# EAGLE design untitled (EAGLE 7.7.0)
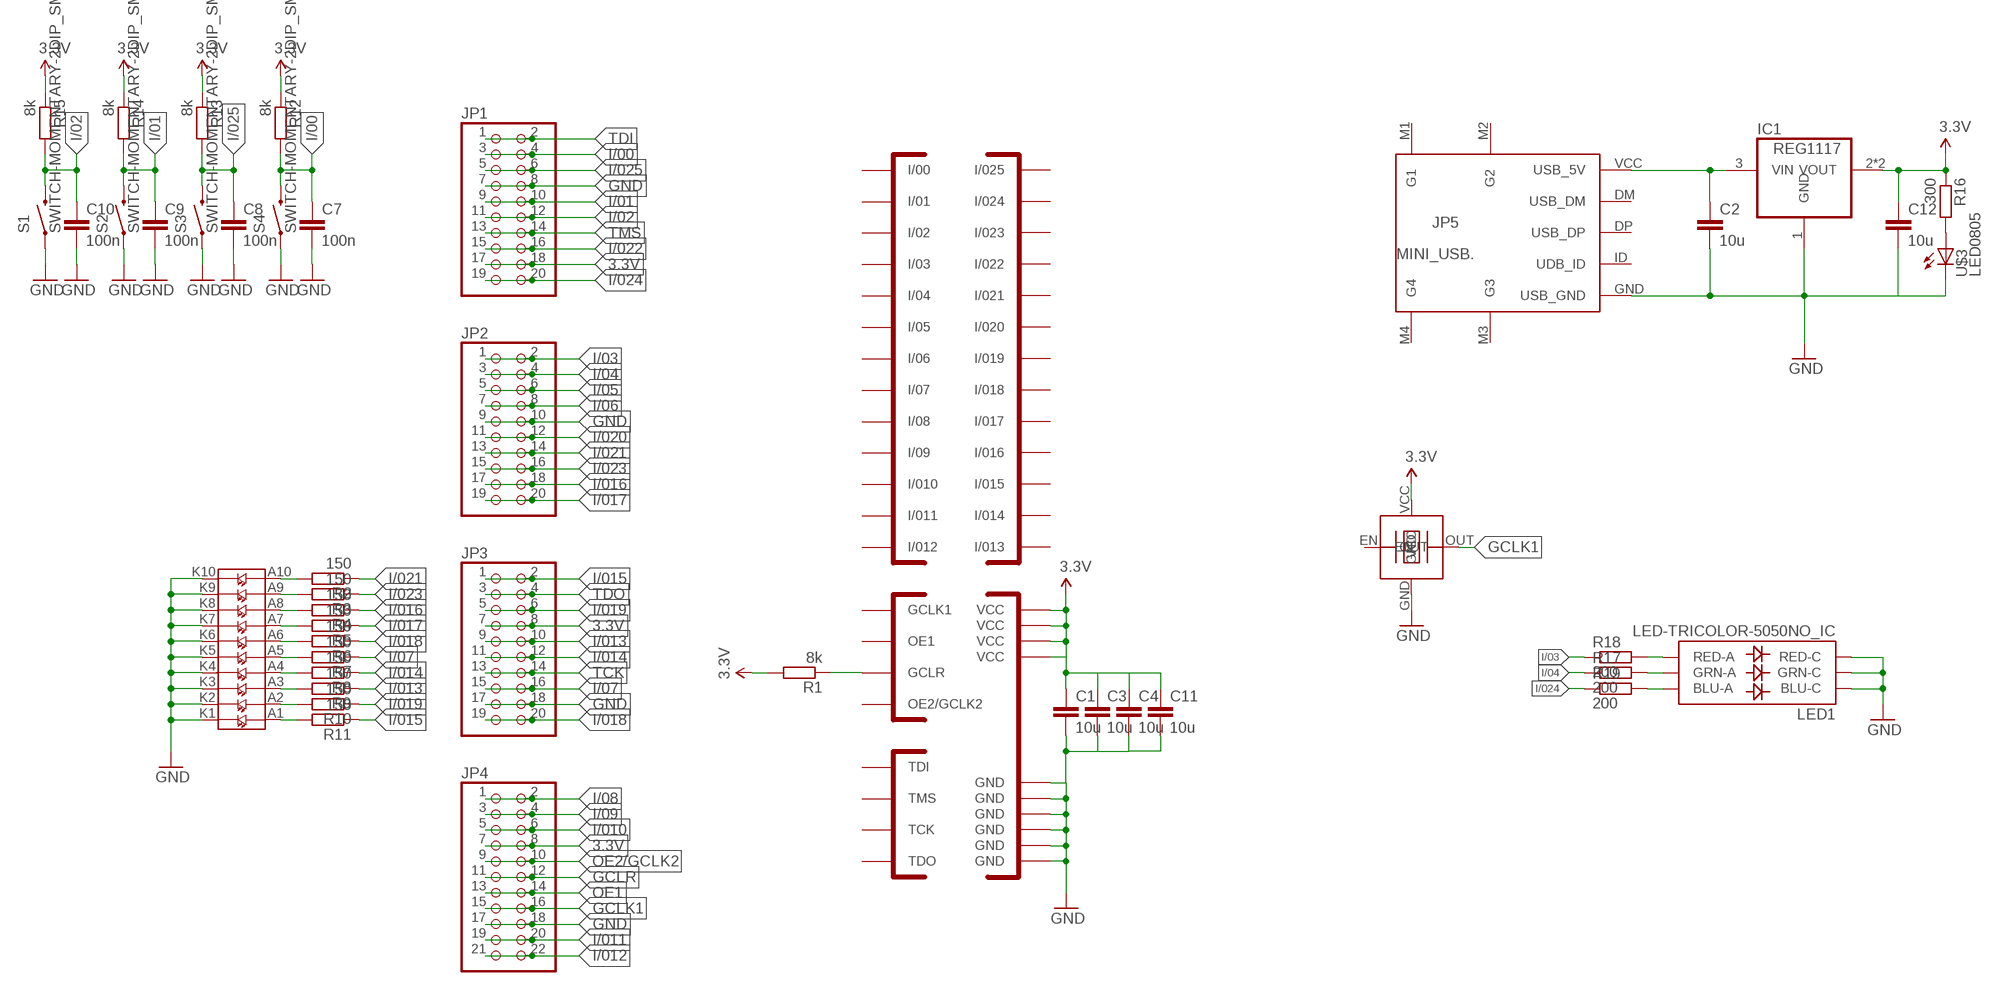
[diagram p0: schematic, sheet 1]

## Parts
C1  10u  CAP0805  [0805]
C2  10u  CC0805  [C0805]
C3  10u  CC0805  [C0805]
C4  10u  CAP0805  [0805]
C7  100n  CC0603  [C0603]
C8  100n  CC0603  [C0603]
C9  100n  CC0603  [C0603]
C10  100n  CC0603  [C0603]
C11  10u  CC0805  [C0805]
C12  10u  CC0805  [C0805]
IC1  REG1117  [SOT223]
JP1  PINHD-2X10_2.54-SMD  [2X10SMD]
JP2  PINHD-2X10_2.54-SMD  [2X10SMD]
JP3  PINHD-2X10_2.54-SMD  [2X10SMD]
JP4  PINHD-2X11_2.54-SMD  [2X11SMD]
JP5  MINI_USB.  [32005-201]
LED1  LED-TRICOLOR-5050NO_IC  [LED-TRICOLOR-5050]
QG1  TXC-BA  [7X5]
R1  8k  R0603  [0603]
R2  150  R0603  [0603]
R3  150  R0603  [0603]
R4  150  R0603  [0603]
R5  150  R0603  [0603]
R6  150  R0603  [0603]
R7  150  R0603  [0603]
R8  150  R0603  [0603]
R9  150  R0603  [0603]
R10  150  R0603  [0603]
R11  150  R0603  [0603]
R12  8k  R0603  [0603]
R13  8k  R0603  [0603]
R14  8k  R0603  [0603]
R15  8k  R0603  [0603]
R16  300  R0603  [0603]
R17  200  R0603  [0603]
R18  200  R0603  [0603]
R19  200  R0603  [0603]
S1  SWITCH-MOMENTARY-2DIP_SMD  [DIP_SMD]
S2  SWITCH-MOMENTARY-2DIP_SMD  [DIP_SMD]
S3  SWITCH-MOMENTARY-2DIP_SMD  [DIP_SMD]
S4  SWITCH-MOMENTARY-2DIP_SMD  [DIP_SMD]
U$1  EPM3032  [TQFP44]
U$2  10LED  [10LED]
U$3  LED0805  [0805-LED]

## Nets
3.3V: C1.1 C3.1 C4.1 C11.1 C12.1 IC1.2(VOUT) IC1.4(VOUT) JP1.17 JP1.18 JP3.7 JP3.8 JP4.7 JP4.8 QG1.VCC R1.2 R12.1 R13.1 R14.1 R15.1 R16.1 U$1.9(VCC) U$1.17(VCC) U$1.29(VCC) U$1.41(VCC)
5V: C2.1 IC1.3(VIN) JP5.VCC(USB_5V)
GCLK1: JP4.15 JP4.16 QG1.OUT
GCLR: JP4.11 JP4.12 R1.1 U$1.39(GCLR)
GND: C1.2 C2.2 C3.2 C4.2 C7.2 C8.2 C9.2 C10.2 C11.2 C12.2 IC1.1(GND) JP1.7 JP1.8 JP2.9 JP2.10 JP3.17 JP3.18 JP4.17 JP4.18 JP5.GND(USB_GND) LED1.4(BLU-C) LED1.5(RED-C) LED1.6(GRN-C) QG1.GND S1.P$1 S1.P$2 S2.P$1 S2.P$2 S3.P$1 S3.P$2 S4.P$1 S4.P$2 U$1.4(GND) U$1.11(GND) U$1.16(GND) U$1.24(GND) U$1.30(GND) U$1.36(GND) U$2.K1 U$2.K2 U$2.K3 U$2.K4 U$2.K5 U$2.K6 U$2.K7 U$2.K8 U$2.K9 U$2.K10 U$3.C
I/00: C7.1 JP1.3 JP1.4 R12.2 S4.P$3 S4.P$4
I/01: C9.1 JP1.9 JP1.10 R14.2 S2.P$3 S2.P$4
I/02: C10.1 JP1.11 JP1.12 R15.2 S1.P$3 S1.P$4
I/03: JP2.1 JP2.2 R18.1
I/04: JP2.3 JP2.4 R17.1
I/05: JP2.5 JP2.6
I/06: JP2.7 JP2.8
I/07: JP3.15 JP3.16 R7.1
I/08: JP4.1 JP4.2
I/09: JP4.3 JP4.4
I/010: JP4.5 JP4.6
I/011: JP4.19 JP4.20
I/012: JP4.21 JP4.22
I/013: JP3.9 JP3.10 R9.1
I/014: JP3.11 JP3.12 R8.1
I/015: JP3.1 JP3.2 R11.1
I/016: JP2.17 JP2.18 R4.1
I/017: JP2.19 JP2.20 R5.1
I/018: JP3.19 JP3.20 R6.1
I/019: JP3.5 JP3.6 R10.1
I/020: JP2.11 JP2.12
I/021: JP2.13 JP2.14 R2.1
I/022: JP1.15 JP1.16
I/023: JP2.15 JP2.16 R3.1
I/024: JP1.19 JP1.20 R19.1
I/025: C8.1 JP1.5 JP1.6 R13.2 S3.P$3 S3.P$4
N$1: R2.2 U$2.A10
N$2: R3.2 U$2.A9
N$3: R4.2 U$2.A8
N$4: R5.2 U$2.A7
N$5: R6.2 U$2.A6
N$6: R7.2 U$2.A5
N$7: R8.2 U$2.A4
N$8: R9.2 U$2.A3
N$9: R10.2 U$2.A2
N$10: R11.2 U$2.A1
N$113: LED1.2(RED-A) R18.2
N$341: R16.2 U$3.A
N$343: LED1.1(GRN-A) R17.2
N$344: LED1.3(BLU-A) R19.2
OE1: JP4.13 JP4.14
OE2/GCLK2: JP4.9 JP4.10
TCK: JP3.13 JP3.14
TDI: JP1.1 JP1.2
TDO: JP3.3 JP3.4
TMS: JP1.13 JP1.14
Unconnected: JP5.DM(USB_DM) JP5.DP(USB_DP) JP5.ID(UDB_ID) JP5.M1(G1) JP5.M2(G2) JP5.M3(G3) JP5.M4(G4) QG1.EN

## Power pins joined to a net without a drawn wire
GCLK1: U$1.37(GCLK1)
I/00: U$1.2(I/00)
I/01: U$1.5(I/01)
I/02: U$1.6(I/02)
I/03: U$1.12(I/03)
I/04: U$1.13(I/04)
I/05: U$1.14(I/05)
I/06: U$1.15(I/06)
I/07: U$1.25(I/07)
I/08: U$1.44(I/08)
I/09: U$1.43(I/09)
I/010: U$1.42(I/010)
I/011: U$1.35(I/011)
I/012: U$1.34(I/012)
I/013: U$1.28(I/013)
I/014: U$1.27(I/014)
I/015: U$1.33(I/015)
I/016: U$1.21(I/016)
I/017: U$1.22(I/017)
I/018: U$1.23(I/018)
I/019: U$1.31(I/019)
I/020: U$1.18(I/020)
I/021: U$1.19(I/021)
I/022: U$1.8(I/022)
I/023: U$1.20(I/023)
I/024: U$1.10(I/024)
I/025: U$1.3(I/025)
OE1: U$1.38(OE1)
OE2/GCLK2: U$1.40(OE2/GCLK2)
TCK: U$1.26(TCK)
TDI: U$1.1(TDI)
TDO: U$1.32(TDO)
TMS: U$1.7(TMS)

## Library data of the parts
C1 C4 = SparkFun-Passives:CAP: Capacitor Standard 0603 ceramic capacitor, and 0.1" leaded capacitor.
C2 C3 C7-C12 = smalsmd:C: Capacitor
IC1 = burr-brown:REG1117: 800mA and 1A Low Dropout (LDO) Positive Regulator 1.8V, 2.5V, 2.85V, 3.3V, 5V, and Adj; MPN: REG1117; OC_FARNELL: 1097566; OC_NEWARK: 14P6981
JP1-JP3 = pinhead-2:PINHD-2X10: PIN HEADER
JP4 = pinhead-2:PINHD-2X11: PIN HEADER
JP5 = connectors:MINI_USB
LED1 = SparkFun-LED:LED-TRICOLOR-5050; PROD_ID: DIO-10298
QG1 = txc:TXC-BA**
R1-R19 = smalsmd:R
S1-S4 = Electromechanical:SWITCH-MOMENTARY-2: Various NO switches- pushbuttons, reed, etc
U$1 = EPM3032:EPM3032
U$2 = strangeLed:10LED
U$3 = smalsmd:LED

## Board
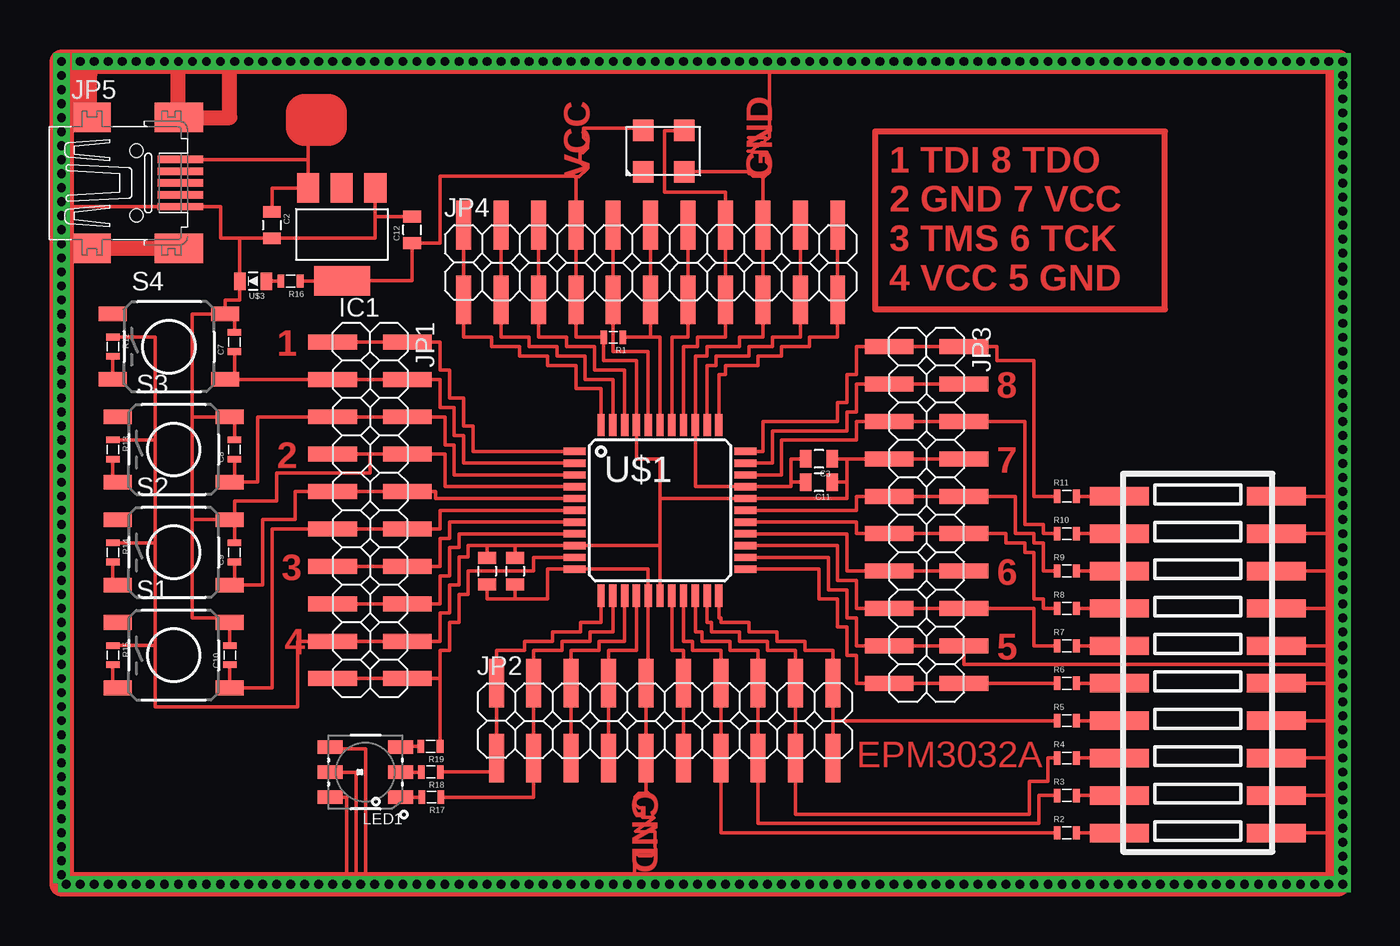
[diagram p1: board, top side]

No outline drawn. Coordinates in mm, seen from the top.
Copper layers (1*16): Top 0.035mm / dielectric 1.5mm / Bottom 0.035mm
Design rules "SparkFun": minimum track width 8mil, minimum drill 20mil, track to track 8mil, track to pad 8mil, pad to pad 8mil, via to via 8mil, smd to smd 8mil, copper to edge 10mil, drill to drill 8mil, minimum pad ring 12mil, minimum via ring 10mil, stop-mask expansion 4mil, vias tented up to drill 25mil, thermal gap 10mil

### Footprints (pad centres in the part's own frame; a part is rotated, then mirrored left to right if it is on the bottom)
0805 = smd 0.8 x 1.2: 1 -0.9,0; 2 0.9,0
C0805 = smd 0.8 x 1.2: 1 -0.9,0; 2 0.9,0
C0603 = smd 0.45 x 0.9: 1 -0.65,0; 2 0.65,0
SOT223 = smd 1.499 x 2.007: 1 -2.261,-3.15; 2 0.025,-3.15; 3 2.311,-3.15 | smd 3.81 x 2.007: 4 0,3.15
2X10SMD = smd 1.016 x 3.302: 1 -1.27,-3.81; 2 -1.27,1.27; 3 1.27,-3.81; 4 1.27,1.27; 5 3.81,-3.81; 6 3.81,1.27; 7 6.35,-3.81; 8 6.35,1.27; 9 8.89,-3.81; 10 8.89,1.27; 11 11.43,-3.81; 12 11.43,1.27; 13 13.97,-3.81; 14 13.97,1.27; 15 16.51,-3.81; 16 16.51,1.27; 17 19.05,-3.81; 18 19.05,1.27; 19 21.59,-3.81; 20 21.59,1.27
2X11SMD = smd 1.016 x 3.302: 1 -1.27,-3.81; 2 -1.27,1.27; 3 1.27,-3.81; 4 1.27,1.27; 5 3.81,-3.81; 6 3.81,1.27; 7 6.35,-3.81; 8 6.35,1.27; 9 8.89,-3.81; 10 8.89,1.27; 11 11.43,-3.81; 12 11.43,1.27; 13 13.97,-3.81; 14 13.97,1.27; 15 16.51,-3.81; 16 16.51,1.27; 17 19.05,-3.81; 18 19.05,1.27; 19 21.59,-3.81; 20 21.59,1.27; 21 24.13,-3.81; 22 24.13,1.27
32005-201 = smd 3.1 x 0.5: DM 3,0.8; DP 3,0; GND 3,-1.6; ID 3,-0.8; VCC 3,1.6 | smd 2.5 x 2: M1 -3,-4.45; M2 -3,4.45 | smd 3.3 x 2: M3 2.9,4.45; M4 2.9,-4.45 | hole 0.9: 0,2.2; 0,-2.2
LED-TRICOLOR-5050 = smd 1.7 x 0.9: 1 -2.4,1.7; 2 -2.4,0; 3 -2.4,-1.7; 4 2.4,-1.7; 5 2.4,0; 6 2.4,1.7
7X5 = smd 1.4 x 1.45: EN -1.448,-1.465; GND 1.333,-1.465; OUT 1.333,1.345; VCC -1.448,1.345
0603 = smd 0.45 x 0.9: 1 -0.65,0; 2 0.65,0
DIP_SMD = smd 1.9 x 1: P$1 -3.81,2.223; P$2 3.81,2.223; P$3 -3.81,-2.223; P$4 3.81,-2.223
TQFP44 = smd 1.5 x 0.5: 1 -5.8,4; 2 -5.8,3.2; 3 -5.8,2.4; 4 -5.8,1.6; 5 -5.8,0.8; 6 -5.8,0; 7 -5.8,-0.8; 8 -5.8,-1.6; 9 -5.8,-2.4; 10 -5.8,-3.2; 11 -5.8,-4; 23 5.8,-4; 24 5.8,-3.2; 25 5.8,-2.4; 26 5.8,-1.6; 27 5.8,-0.8; 28 5.8,0; 29 5.8,0.8; 30 5.8,1.6; 31 5.8,2.4; 32 5.8,3.2; 33 5.8,4 | smd 0.5 x 1.5: 12 -4,-5.8; 13 -3.2,-5.8; 14 -2.4,-5.8; 15 -1.6,-5.8; 16 -0.8,-5.8; 17 0,-5.8; 18 0.8,-5.8; 19 1.6,-5.8; 20 2.4,-5.8; 21 3.2,-5.8; 22 4,-5.8; 34 4,5.8; 35 3.2,5.8; 36 2.4,5.8; 37 1.6,5.8; 38 0.8,5.8; 39 0,5.8; 40 -0.8,5.8; 41 -1.6,5.8; 42 -2.4,5.8; 43 -3.2,5.8; 44 -4,5.8
10LED = smd 1.25 x 4: A1 -11.43,-5.334; A2 -8.89,-5.334; A3 -6.35,-5.334; A4 -3.81,-5.334; A5 -1.27,-5.334; A6 1.27,-5.334; A7 3.81,-5.334; A8 6.35,-5.334; A9 8.89,-5.334; A10 11.43,-5.334; K1 -11.43,5.334; K2 -8.89,5.334; K3 -6.35,5.334; K4 -3.81,5.334; K5 -1.27,5.334; K6 1.27,5.334; K7 3.81,5.334; K8 6.35,5.334; K9 8.89,5.334; K10 11.43,5.334
0805-LED = smd 0.8 x 1.2: A -0.9,0; C 0.9,0

### Placement (x,y rotation side)
C1  30.8,21.27 270 top
C2  14.29,44.77 270 top
C3  51.44,28.89 180 top
C4  28.89,21.27 270 top
C7  11.75,36.83 90 top
C8  11.75,29.53 90 top
C9  11.75,22.54 90 top
C10  11.43,15.56 90 top
C11  51.44,27.3 180 top
C12  23.81,44.45 90 top
IC1  19.05,44.13 180 top
JP1  22.23,35.56 270 top
JP2  30.8,12.38 0 top
JP3  60.01,35.24 270 top
JP4  28.57,43.5 0 top
JP5  5.08,47.62 0 top
LED1  20.64,7.62 180 top
QG1  TXC-BA*  [7X5]  40.96,49.85 0 top
R1  37.47,37.15 180 top
R2  68.26,3.49 0 top
R3  68.26,6.03 0 top
R4  68.26,8.57 0 top
R5  68.26,11.11 0 top
R6  68.26,13.65 0 top
R7  68.26,16.19 0 top
R8  68.26,18.73 0 top
R9  68.26,21.27 0 top
R10  68.26,23.81 0 top
R11  68.26,26.35 0 top
R12  3.49,36.51 270 top
R13  3.49,29.53 270 top
R14  3.49,22.54 270 top
R15  3.49,15.56 270 top
R16  15.56,40.96 180 top
R17  25.12,5.92 180 top
R18  25.08,7.63 180 top
R19  25.06,9.37 180 top
S1  7.62,15.56 0 top
S2  7.62,22.54 0 top
S3  7.62,29.53 0 top
S4  7.3,36.51 0 top
U$1  40.64,25.4 0 top
U$2  77.15,14.92 270 top
U$3  13.02,40.96 180 top

### Tracks (layer width: path | path; a pad name or v marks a point on that pad's centre or on a via)
3.3V
  Top 0.254: JP3.8 JP3.7 53.34,28.89 | 40.64,23 U$1.9 30.8,23 | 40.64,23 U$1.17 | 40.64,26.2 U$1.29 53.34,26.2 53.34,27.3 | 40.64,26.2 40.64,23 | 40.64,26.2 40.64,28.89 39.05,28.89 39.05,31.2 | 6.35,16.21 6.35,12.06 16.04,12.06 16.04,16.51 16.19,16.51 16.19,16.5 JP1.17 JP1.18 25.72,16.51 25.72,18.41 26.35,18.41 26.35,20.32 26.99,20.32 26.99,22.23 27.62,22.23 27.62,23 28.89,23 | 6.35,16.21 6.35,23.19 | 6.35,23.19 6.35,30.18 | 6.35,30.18 6.35,37.15 3.49,37.15 R12.1 | R13.1 6.35,30.18 | R14.1 6.35,23.19 | R15.1 6.35,16.21 | R16.1 19.05,40.96 IC1.4 23.81,40.98 C12.1 25.72,43.55 25.72,48.11 34.85,48.11 34.85,48.05 34.92,48.05 | 34.92,48.05 JP4.8 JP4.7 34.92,37.15 R1.2 36.81,35.56 39.05,35.56 39.05,31.2 | 34.92,48.05 34.94,48.06 35.16,48.06 35.67,48.58 35.67,48.59 35.22,49.05 35.22,49.7 35.41,49.7 35.71,49.99 35.71,50.43 35.44,50.7 35.44,51.36 39.34,51.36 QG1.VCC | 39.05,31.2 U$1.41 | 30.8,23 28.89,23 | C4.1 28.89,23 | C1.1 30.8,23 | 53.34,27.3 53.34,28.89 | C11.1 53.34,27.3 | C3.1 53.34,28.89
5V
  Top 0.254: 16.74,47.62 IC1.3 | C2.1 14.29,47.28 IC1.3 | JP5.VCC 16.74,49.23 IC1.3
GCLK1
  Top 0.254: QG1.OUT 40.96,51.19 40.96,46.99 45.09,46.99 JP4.16 JP4.15 45.09,37.15 43.18,37.15 43.18,36.51 42.23,36.51 42.23,31.2 U$1.37
GCLR
  Top 0.254: JP4.12 JP4.11 40.01,37.15 | U$1.39 40.64,37.15 40.01,37.15 | R1.1 40.01,37.15
GND  (via drill 0.6)
  Top 0.254: U$1.30 43.04,27 U$1.36 43.04,35.88 43.81,35.88 43.81,36.51 46.04,36.51 46.04,37.15 47.62,37.15 JP4.17 JP4.18 47.62,47.94 | 20.95,29.21 JP1.8 26.04,29.21 26.04,27 U$1.4 | 20.95,29.21 JP1.7 17.14,29.21 17.14,28.89 17.12,28.89 17.12,29.03 | U$1.30 46.44,26.99 | C9.2 11.75,24.77 | 11.75,24.77 S2.P$2 8.89,24.77 | C7.2 11.75,38.73 S4.P$2 | C10.2 S1.P$2 11.43,18.1 8.89,18.1 8.89,24.77 | 8.89,24.77 8.89,31.75 | 8.89,31.75 8.89,38.73 S4.P$2 | C8.2 11.75,31.75 S3.P$2 8.89,31.75 | C12.2 21.31,45.35 | 21.31,45.35 IC1.1 | C2.2 21.31,43.87 21.31,45.35 | 0,46.66 0,46.67 | 39.05,0 arc-90 38.92,0.13 38.92,2.15 39.22,1.92 40.08,1.92 40.35,2.15 40.31,2.82 40.3,3.56 38.98,3.61 40.23,4.5 40.19,4.55 39.47,4.55 39.46,4.56 39.46,5.18 39.2,5.18 38.95,5.43 38.95,5.95 39.18,6.18 39.85,6.18 39.69,6.34 JP2.9 JP2.10 39.84,13.65 U$1.16 39.84,21.4 U$1.11 33.02,21.4 33.02,19.37 30.8,19.37 | 86.04,37.15 arc90 86.68,37.47 | 86.04,34.61 arc-90 86.68,34.29 | 86.04,32.07 arc-90 86.68,31.75 | 86.04,26.99 arc-90 86.68,26.67 86.68,26.35 U$2.K1 | 86.04,24.45 arc-90 86.68,24.13 | 86.04,19.37 arc-90 86.68,19.05 | 86.04,25.72 arc-90 86.68,25.4 | 47.62,47.94 47.94,48.26 47.98,48.26 48.08,48.36 48.08,48.83 47.86,49.05 47.86,49.66 47.92,49.72 46.89,49.72 46.81,49.8 | 46.81,49.8 46.86,49.8 47.19,50.13 47.28,50.13 47.52,50.37 47.65,50.37 47.88,50.59 | 47.88,50.59 47.93,50.65 47.98,50.65 48.06,50.73 48.06,55.38 48.24,55.88 48.9,55.56 49.21,55.24 | 46.63,49.8 46.81,49.8 | 46.66,50.72 46.66,50.7 47.76,50.7 arc-90 47.88,50.59 | U$3.C 12.1,40.33 | QG1.GND 46.67,48.38 46.67,48.26 46.8,48.26 46.96,48.09 47.47,48.09 47.62,47.94
  Top 0.254: 17.67,0 19.37,0 19.37,5.92 LED1.6 | C4.2 28.89,19.37 30.8,19.37 | C1.2 30.8,19.37 | U$1.24 52.07,22.2 52.07,20 53.34,20 53.34,18.1 53.98,18.1 53.98,16.19 JP3.17 JP3.18 61.28,14.92 86.68,14.92 86.68,14.61 87,14.61 | U$1.30 49.53,27 49.53,27.3 | 49.53,27.3 49.53,28.89 C3.2 | C11.2 49.53,27.3 | U$2.K2 86.68,23.81 86.68,23.5 | U$2.K3 86.68,21.27 86.68,20.95 | U$2.K4 86.68,18.73 | U$2.K5 86.68,16.19 86.68,15.88 | U$2.K6 86.68,13.65 | U$2.K7 86.68,11.11 86.68,10.79 | U$2.K8 86.68,8.57 86.68,8.26 | U$2.K9 86.68,6.03 86.68,5.71 | U$2.K10 86.68,3.49 86.68,3.17 | 0,45.4 0,46.02 JP5.GND 8.08,46.04 10.79,46.04 10.79,43.87 C2.2 | 0,43.87 0,43.81 | C2.2 12.1,43.87 12.1,40.33 | 12.1,40.33 12.1,39.69 11.11,39.69 S4.P$2 | 20.95,29.21 20.95,27.94 14.61,27.94 14.61,26.04 11.75,26.04 11.75,24.77 | LED1.4 18.24,9.21 20.64,9.21 20.64,0 | LED1.5 20,7.62 20,0
  Top 0.406: 0,52.7 0,45.4
  Top 1.016: 7.94,52.07 7.94,55.88 | 1.91,55.88 1.91,54.93 | 1.91,52.07 1.91,54.93 | 1.91,54.93 0.95,54.93 0.95,53.34 | 7.94,43.18 0,43.18
  Top 1.676: v0,55.88 v1.27,55.88 1.91,55.88 7.94,55.88 48.24,55.88 86.68,55.88 86.68,37.47 86.68,34.29 86.68,31.75 86.68,26.67 86.68,25.4 86.68,24.13 86.68,23.5 86.68,20.95 86.68,19.05 86.68,18.73 86.68,15.88 86.68,14.92 86.68,13.65 86.68,10.79 86.68,8.26 86.68,5.71 86.68,3.17 86.68,0 39.05,0 20.64,0 20,0 19.37,0 v0.32,0 0,0 0,43.18 0,43.81 0,45.4 0,46.67 0,52.7 v0,55.88
I/00
  Top 0.254: C7.1 11.75,34.61 11.43,34.29 S4.P$4 JP1.3 JP1.4 25.72,34.29 25.72,32.38 26.67,32.38 26.67,30.48 27.3,30.48 27.3,28.6 U$1.2 | R12.2 S4.P$3
I/01
  Top 0.254: C9.1 11.75,20.32 S2.P$4 13.65,20.32 13.65,24.77 15.88,24.77 15.88,26.67 JP1.9 JP1.10 25.4,26.67 25.4,26.2 U$1.5 | R14.2 3.49,20.32 S2.P$3
I/02
  Top 0.254: C10.1 S1.P$4 14.29,13.34 14.29,24.13 JP1.11 JP1.12 25.72,24.13 25.72,25.4 U$1.6 | S1.P$3 3.49,13.34 R15.2
I/03
  Top 0.254: U$1.12 36.64,17.78 35.24,17.78 35.24,17.14 33.34,17.14 33.34,16.51 31.43,16.51 31.43,15.88 29.53,15.88 JP2.2 JP2.1 29.53,7.63 R18.1
I/04
  Top 0.254: U$1.13 37.47,19.6 37.47,17.14 35.88,17.14 35.88,16.51 33.97,16.51 33.97,15.88 32.07,15.88 JP2.4 JP2.3 32.07,5.92 R17.1
I/05
  Top 0.254: JP2.5 JP2.6 34.61,15.88 36.51,15.88 36.51,16.51 38.24,16.51 U$1.14
I/06
  Top 0.254: JP2.7 JP2.8 37.15,15.88 39.04,15.88 U$1.15
I/07
  Top 0.254: U$1.25 52.7,23 52.7,20.64 53.98,20.64 53.98,18.73 JP3.15 JP3.16 66.04,18.73 66.04,16.19 R7.1
I/08
  Top 0.254: JP4.2 JP4.1 27.3,37.15 29.21,37.15 29.21,36.51 31.11,36.51 31.11,35.88 33.02,35.88 33.02,35.24 34.92,35.24 34.92,33.66 36.64,33.66 U$1.44
I/09
  Top 0.254: JP4.4 JP4.3 29.84,37.15 31.75,37.15 31.75,36.51 33.66,36.51 33.66,35.88 35.56,35.88 35.56,34.29 37.44,34.29 U$1.43
I/010
  Top 0.254: JP4.6 JP4.5 32.38,37.15 34.29,37.15 34.29,36.51 36.2,36.51 36.2,34.92 38.24,34.92 U$1.42
I/011
  Top 0.254: JP4.20 JP4.19 50.16,37.15 48.26,37.15 48.26,36.51 46.67,36.51 46.67,35.88 44.45,35.88 44.45,35.24 43.84,35.24 U$1.35
I/012
  Top 0.254: JP4.22 JP4.21 52.7,37.15 50.8,37.15 50.8,36.51 48.9,36.51 48.9,35.88 47.31,35.88 47.31,35.24 45.09,35.24 45.09,34.61 44.64,34.61 U$1.34
I/013
  Top 0.254: U$1.28 53.98,25.4 53.98,26.35 JP3.9 JP3.10 64.77,26.35 64.77,23.81 66.04,23.81 66.04,23.18 66.67,23.18 66.67,21.27 R9.1
I/014
  Top 0.254: U$1.27 53.98,24.6 53.98,23.81 JP3.11 JP3.12 64.14,23.81 64.14,23.18 65.41,23.18 65.41,22.54 66.04,22.54 66.04,19.37 66.67,19.37 66.67,18.73 R8.1
I/015
  Top 0.254: U$1.33 47.62,29.4 47.62,31.43 52.7,31.43 52.7,32.7 53.34,32.7 53.34,34.61 53.98,34.61 53.98,36.51 JP3.1 JP3.2 63.5,36.51 63.5,35.56 66.04,35.56 66.04,26.35 R11.1
I/016
  Top 0.254: U$1.21 43.84,17.78 44.13,17.78 44.13,17.14 46.04,17.14 46.04,16.51 47.94,16.51 47.94,15.88 49.85,15.88 JP2.18 JP2.17 49.85,4.76 65.72,4.76 65.72,6.99 66.99,6.99 66.99,8.57 R4.1
I/017
  Top 0.254: 52.39,11.11 JP2.20 52.39,15.88 50.48,15.88 50.48,16.51 48.58,16.51 48.58,17.14 46.67,17.14 46.67,17.78 44.77,17.78 44.77,18.1 44.64,18.1 U$1.22 | 52.39,11.11 JP2.19 | R5.1 52.39,11.11
I/018
  Top 0.254: U$1.23 51.44,21.4 51.44,19.37 52.7,19.37 52.7,17.46 53.34,17.46 53.34,15.56 53.98,15.56 53.98,13.65 JP3.19 JP3.20 R6.1
I/019
  Top 0.254: U$1.31 48.9,27.8 48.9,30.16 53.98,30.16 53.98,31.43 JP3.5 JP3.6 65.41,31.43 65.41,24.45 66.67,24.45 66.67,23.81 R10.1
I/020
  Top 0.254: JP2.11 JP2.12 42.23,15.88 41.44,15.88 U$1.18
I/021
  Top 0.254: U$1.19 42.23,19.6 42.23,16.51 42.86,16.51 42.86,15.88 44.77,15.88 JP2.14 JP2.13 44.77,3.49 R2.1
I/022
  Top 0.254: JP1.15 JP1.16 25.72,19.05 25.72,20.95 26.35,20.95 26.35,22.86 26.99,22.86 26.99,23.8 U$1.8
I/023
  Top 0.254: U$1.20 43.04,17.14 43.5,17.14 43.5,16.51 45.4,16.51 45.4,15.88 47.31,15.88 JP2.16 JP2.15 47.31,4.13 66.36,4.13 66.36,6.03 R3.1
I/024
  Top 0.254: U$1.10 32.07,22.2 32.07,21.27 27.62,21.27 27.62,19.68 26.99,19.68 26.99,17.78 26.35,17.78 26.35,15.88 25.72,15.88 25.72,13.97 | 25.72,13.97 JP1.20 JP1.19 | R19.1 25.72,13.97
I/025
  Top 0.254: C8.1 11.75,27.3 S3.P$4 13.34,27.3 13.34,31.75 JP1.5 JP1.6 26.04,31.75 26.04,29.84 26.67,29.84 26.67,27.8 U$1.3 | R13.2 3.49,27.3 S3.P$3
N$1
  Top 0.254: R2.2 U$2.A10
N$2
  Top 0.254: R3.2 U$2.A9
N$3
  Top 0.254: R4.2 U$2.A8
N$4
  Top 0.254: R5.2 U$2.A7
N$5
  Top 0.254: R6.2 U$2.A6
N$6
  Top 0.254: R7.2 U$2.A5
N$7
  Top 0.254: R8.2 U$2.A4
N$8
  Top 0.254: R9.2 U$2.A3
N$9
  Top 0.254: R10.2 U$2.A2
N$10
  Top 0.254: R11.2 U$2.A1
N$11
  Top 0.254: 16.83,47.31 16.75,47.31 16.75,51.52
  Top 2.54: 16.75,51.52 16.83,51.52 16.83,51.44 18.1,51.44 18.1,52.39 16.51,52.39 16.51,51.44
N$12
  Top 1.016: 8.26,52.07 11.43,52.07 11.43,55.56
N$13  (via drill 0.6)
  other vias: 5.08,55.88
N$14  (via drill 0.6)
  other vias: 6.03,55.88
N$15  (via drill 0.6)
  other vias: 6.99,55.88
N$16  (via drill 0.6)
  other vias: 7.94,55.88
N$17  (via drill 0.6)
  other vias: 8.89,55.88
N$18  (via drill 0.6)
  other vias: 9.84,55.88
N$19  (via drill 0.6)
  other vias: 10.79,55.88
N$20  (via drill 0.6)
  other vias: 11.75,55.88
N$21  (via drill 0.6)
  other vias: 12.7,55.88
N$22  (via drill 0.6)
  other vias: 13.65,55.88
N$23  (via drill 0.6)
  other vias: 14.61,55.88
N$24  (via drill 0.6)
  other vias: 15.56,55.88
N$25  (via drill 0.6)
  other vias: 16.51,55.88
N$26  (via drill 0.6)
  other vias: 17.46,55.88
N$27  (via drill 0.6)
  other vias: 18.41,55.88
N$28  (via drill 0.6)
  other vias: 19.37,55.88
N$29  (via drill 0.6)
  other vias: 20.32,55.88
N$30  (via drill 0.6)
  other vias: 21.27,55.88
N$31  (via drill 0.6)
  other vias: 22.23,55.88
N$32  (via drill 0.6)
  other vias: 23.18,55.88
N$33  (via drill 0.6)
  other vias: 24.13,55.88
N$34  (via drill 0.6)
  other vias: 25.08,55.88
N$35  (via drill 0.6)
  other vias: 26.04,55.88
N$36  (via drill 0.6)
  other vias: 26.99,55.88
N$37  (via drill 0.6)
  other vias: 27.94,55.88
N$38  (via drill 0.6)
  other vias: 28.89,55.88
N$39  (via drill 0.6)
  other vias: 29.84,55.88
N$40  (via drill 0.6)
  other vias: 30.8,55.88
N$41  (via drill 0.6)
  other vias: 31.75,55.88
N$42  (via drill 0.6)
  other vias: 32.7,55.88
N$43  (via drill 0.6)
  other vias: 33.66,55.88
N$44  (via drill 0.6)
  other vias: 34.61,55.88
N$45  (via drill 0.6)
  other vias: 35.56,55.88
N$46  (via drill 0.6)
  other vias: 36.51,55.88
N$47  (via drill 0.6)
  other vias: 37.47,55.88
N$48  (via drill 0.6)
  other vias: 38.42,55.88
N$49  (via drill 0.6)
  other vias: 39.37,55.88
N$50  (via drill 0.6)
  other vias: 40.32,55.88
N$51  (via drill 0.6)
  other vias: 41.27,55.88
N$52  (via drill 0.6)
  other vias: 42.23,55.88
N$53  (via drill 0.6)
  other vias: 43.18,55.88
N$54  (via drill 0.6)
  other vias: 44.13,55.88
N$55  (via drill 0.6)
  other vias: 45.09,55.88
N$56  (via drill 0.6)
  other vias: 46.04,55.88
N$57  (via drill 0.6)
  other vias: 46.99,55.88
N$58  (via drill 0.6)
  other vias: 47.94,55.88
N$59  (via drill 0.6)
  other vias: 48.9,55.88
N$60  (via drill 0.6)
  other vias: 49.85,55.88
N$61  (via drill 0.6)
  other vias: 50.8,55.88
N$62  (via drill 0.6)
  other vias: 51.75,55.88
N$63  (via drill 0.6)
  other vias: 52.7,55.88
N$64  (via drill 0.6)
  other vias: 53.66,55.88
N$65  (via drill 0.6)
  other vias: 54.61,55.88
N$66  (via drill 0.6)
  other vias: 55.56,55.88
N$67  (via drill 0.6)
  other vias: 56.52,55.88
N$68  (via drill 0.6)
  other vias: 57.47,55.88
N$69  (via drill 0.6)
  other vias: 58.42,55.88
N$70  (via drill 0.6)
  other vias: 59.37,55.88
N$71  (via drill 0.6)
  other vias: 60.33,55.88
N$72  (via drill 0.6)
  other vias: 61.28,55.88
N$73  (via drill 0.6)
  other vias: 62.23,55.88
N$74  (via drill 0.6)
  other vias: 63.18,55.88
N$75  (via drill 0.6)
  other vias: 64.14,55.88
N$76  (via drill 0.6)
  other vias: 65.09,55.88
N$77  (via drill 0.6)
  other vias: 66.04,55.88
N$78  (via drill 0.6)
  other vias: 66.99,55.88
N$79  (via drill 0.6)
  other vias: 67.94,55.88
N$80  (via drill 0.6)
  other vias: 68.9,55.88
N$81  (via drill 0.6)
  other vias: 69.85,55.88
N$82  (via drill 0.6)
  other vias: 70.8,55.88
N$83  (via drill 0.6)
  other vias: 71.75,55.88
N$84  (via drill 0.6)
  other vias: 72.71,55.88
N$85  (via drill 0.6)
  other vias: 73.66,55.88
N$86  (via drill 0.6)
  other vias: 74.61,55.88
N$87  (via drill 0.6)
  other vias: 75.56,55.88
N$88  (via drill 0.6)
  other vias: 76.52,55.88
N$89  (via drill 0.6)
  other vias: 77.47,55.88
N$90  (via drill 0.6)
  other vias: 78.42,55.88
N$91  (via drill 0.6)
  other vias: 79.38,55.88
N$92  (via drill 0.6)
  other vias: 81.28,55.88
N$93  (via drill 0.6)
  other vias: 83.19,55.88
N$94  (via drill 0.6)
  other vias: 85.09,55.88
N$97  (via drill 0.6)
  other vias: 80.33,55.88
N$98  (via drill 0.6)
  other vias: 82.23,55.88
N$99  (via drill 0.6)
  other vias: 84.14,55.88
N$103  (via drill 0.6)
  other vias: 86.04,55.88
N$107  (via drill 0.6)
  other vias: 87,55.88
N$108  (via drill 0.6)
  other vias: 87,54.93
N$109  (via drill 0.6)
  other vias: 4.13,0
N$110  (via drill 0.6)
  other vias: 5.08,0
N$111  (via drill 0.6)
  other vias: 0,54.93
N$113
  Top 0.254: LED1.2 R18.2
N$118  (via drill 0.6)
  other vias: 2.22,55.88
N$119  (via drill 0.6)
  other vias: 3.17,55.88
N$120  (via drill 0.6)
  other vias: 4.13,55.88
N$121  (via drill 0.6)
  other vias: 6.03,0
N$122  (via drill 0.6)
  other vias: 6.99,0
N$123  (via drill 0.6)
  other vias: 7.94,0
N$124  (via drill 0.6)
  other vias: 8.89,0
N$125  (via drill 0.6)
  other vias: 9.84,0
N$126  (via drill 0.6)
  other vias: 10.79,0
N$127  (via drill 0.6)
  other vias: 11.75,0
N$128  (via drill 0.6)
  other vias: 12.7,0
N$129  (via drill 0.6)
  other vias: 13.65,0
N$130  (via drill 0.6)
  other vias: 14.61,0
N$131  (via drill 0.6)
  other vias: 15.56,0
N$132  (via drill 0.6)
  other vias: 16.51,0
N$133  (via drill 0.6)
  other vias: 17.46,0
N$134  (via drill 0.6)
  other vias: 18.41,0
N$135  (via drill 0.6)
  other vias: 19.37,0
N$136  (via drill 0.6)
  other vias: 20.32,0
N$137  (via drill 0.6)
  other vias: 21.27,0
N$138  (via drill 0.6)
  other vias: 22.23,0
N$139  (via drill 0.6)
  other vias: 23.18,0
N$140  (via drill 0.6)
  other vias: 24.13,0
N$141  (via drill 0.6)
  other vias: 25.08,0
N$142  (via drill 0.6)
  other vias: 26.04,0
N$143  (via drill 0.6)
  other vias: 26.99,0
N$144  (via drill 0.6)
  other vias: 27.94,0
N$145  (via drill 0.6)
  other vias: 28.89,0
N$146  (via drill 0.6)
  other vias: 29.84,0
N$147  (via drill 0.6)
  other vias: 30.8,0
N$148  (via drill 0.6)
  other vias: 31.75,0
N$149  (via drill 0.6)
  other vias: 32.7,0
N$150  (via drill 0.6)
  other vias: 33.66,0
N$151  (via drill 0.6)
  other vias: 34.61,0
N$152  (via drill 0.6)
  other vias: 35.56,0
N$153  (via drill 0.6)
  other vias: 36.51,0
N$154  (via drill 0.6)
  other vias: 37.47,0
N$155  (via drill 0.6)
  other vias: 38.42,0
N$156  (via drill 0.6)
  other vias: 39.37,0
N$157  (via drill 0.6)
  other vias: 40.32,0
N$158  (via drill 0.6)
  other vias: 41.27,0
N$159  (via drill 0.6)
  other vias: 42.23,0
N$160  (via drill 0.6)
  other vias: 43.18,0
N$161  (via drill 0.6)
  other vias: 44.13,0
N$162  (via drill 0.6)
  other vias: 45.09,0
N$163  (via drill 0.6)
  other vias: 46.04,0
N$164  (via drill 0.6)
  other vias: 46.99,0
N$165  (via drill 0.6)
  other vias: 47.94,0
N$166  (via drill 0.6)
  other vias: 48.9,0
N$167  (via drill 0.6)
  other vias: 49.85,0
N$168  (via drill 0.6)
  other vias: 50.8,0
N$169  (via drill 0.6)
  other vias: 51.75,0
N$170  (via drill 0.6)
  other vias: 52.7,0
N$171  (via drill 0.6)
  other vias: 53.66,0
N$172  (via drill 0.6)
  other vias: 54.61,0
N$173  (via drill 0.6)
  other vias: 55.56,0
N$174  (via drill 0.6)
  other vias: 56.52,0
N$175  (via drill 0.6)
  other vias: 57.47,0
N$176  (via drill 0.6)
  other vias: 58.42,0
N$177  (via drill 0.6)
  other vias: 59.37,0
N$178  (via drill 0.6)
  other vias: 60.33,0
N$179  (via drill 0.6)
  other vias: 61.28,0
N$180  (via drill 0.6)
  other vias: 62.23,0
N$181  (via drill 0.6)
  other vias: 63.18,0
N$182  (via drill 0.6)
  other vias: 64.14,0
N$183  (via drill 0.6)
  other vias: 65.09,0
N$184  (via drill 0.6)
  other vias: 66.04,0
N$185  (via drill 0.6)
  other vias: 66.99,0
N$186  (via drill 0.6)
  other vias: 67.94,0
N$187  (via drill 0.6)
  other vias: 68.9,0
N$188  (via drill 0.6)
  other vias: 69.85,0
N$189  (via drill 0.6)
  other vias: 70.8,0
N$190  (via drill 0.6)
  other vias: 71.75,0
N$191  (via drill 0.6)
  other vias: 72.71,0
N$192  (via drill 0.6)
  other vias: 73.66,0
N$193  (via drill 0.6)
  other vias: 74.61,0
N$194  (via drill 0.6)
  other vias: 75.56,0
N$195  (via drill 0.6)
  other vias: 76.52,0
N$196  (via drill 0.6)
  other vias: 77.47,0
N$197  (via drill 0.6)
  other vias: 78.42,0
N$198  (via drill 0.6)
  other vias: 79.38,0
N$200  (via drill 0.6)
  other vias: 80.33,0
N$203  (via drill 0.6)
  other vias: 84.14,0
N$207  (via drill 0.6)
  other vias: 82.23,0
N$210  (via drill 0.6)
  other vias: 81.28,0
N$211  (via drill 0.6)
  other vias: 83.19,0
N$212  (via drill 0.6)
  other vias: 86.04,0
N$213  (via drill 0.6)
  other vias: 85.09,0
N$214  (via drill 0.6)
  other vias: 0,9.21
N$222  (via drill 0.6)
  other vias: 1.27,0
N$223  (via drill 0.6)
  other vias: 2.22,0
N$224  (via drill 0.6)
  other vias: 3.17,0
N$225  (via drill 0.6)
  other vias: 0,10.16
N$226  (via drill 0.6)
  other vias: 0,11.11
N$227  (via drill 0.6)
  other vias: 0,12.06
N$228  (via drill 0.6)
  other vias: 0,13.02
N$229  (via drill 0.6)
  other vias: 0,13.97
N$230  (via drill 0.6)
  other vias: 0,14.92
N$231  (via drill 0.6)
  other vias: 0,15.88
N$232  (via drill 0.6)
  other vias: 0,16.83
N$233  (via drill 0.6)
  other vias: 0,17.78
N$234  (via drill 0.6)
  other vias: 0,18.73
N$235  (via drill 0.6)
  other vias: 0,19.68
N$236  (via drill 0.6)
  other vias: 0,20.64
N$237  (via drill 0.6)
  other vias: 0,21.59
N$238  (via drill 0.6)
  other vias: 0,22.54
N$239  (via drill 0.6)
  other vias: 0,23.5
N$240  (via drill 0.6)
  other vias: 0,24.45
N$241  (via drill 0.6)
  other vias: 0,25.4
N$242  (via drill 0.6)
  other vias: 0,26.35
N$243  (via drill 0.6)
  other vias: 0,27.3
N$244  (via drill 0.6)
  other vias: 0,28.26
N$245  (via drill 0.6)
  other vias: 0,29.21
N$246  (via drill 0.6)
  other vias: 0,30.16
N$247  (via drill 0.6)
  other vias: 0,31.11
N$248  (via drill 0.6)
  other vias: 0,32.07
N$249  (via drill 0.6)
  other vias: 0,33.02
N$250  (via drill 0.6)
  other vias: 0,33.97
N$251  (via drill 0.6)
  other vias: 0,34.92
N$252  (via drill 0.6)
  other vias: 0,35.88
N$253  (via drill 0.6)
  other vias: 0,36.83
N$254  (via drill 0.6)
  other vias: 0,37.78
N$255  (via drill 0.6)
  other vias: 0,38.73
N$256  (via drill 0.6)
  other vias: 0,39.69
N$257  (via drill 0.6)
  other vias: 0,40.64
N$258  (via drill 0.6)
  other vias: 0,41.59
N$259  (via drill 0.6)
  other vias: 0,42.55
N$260  (via drill 0.6)
  other vias: 0,43.5
N$261  (via drill 0.6)
  other vias: 0,44.45
N$262  (via drill 0.6)
  other vias: 0,45.4
N$263  (via drill 0.6)
  other vias: 0,46.35
N$264  (via drill 0.6)
  other vias: 0,47.31
N$265  (via drill 0.6)
  other vias: 0,48.26
N$266  (via drill 0.6)
  other vias: 0,49.21
N$267  (via drill 0.6)
  other vias: 0,50.16
N$268  (via drill 0.6)
  other vias: 0,51.12
N$269  (via drill 0.6)
  other vias: 0,52.07
N$270  (via drill 0.6)
  other vias: 0,53.02
N$271  (via drill 0.6)
  other vias: 0,53.98
N$273  (via drill 0.6)
  other vias: 0,0.64
N$274  (via drill 0.6)
  other vias: 0,1.59
N$275  (via drill 0.6)
  other vias: 0,2.54
N$276  (via drill 0.6)
  other vias: 0,3.49
N$277  (via drill 0.6)
  other vias: 0,4.45
N$278  (via drill 0.6)
  other vias: 0,5.4
N$279  (via drill 0.6)
  other vias: 0,6.35
N$280  (via drill 0.6)
  other vias: 0,7.3
N$281  (via drill 0.6)
  other vias: 0,8.26
N$282  (via drill 0.6)
  other vias: 87,9.53
N$283  (via drill 0.6)
  other vias: 87,10.48
N$284  (via drill 0.6)
  other vias: 87,11.43
N$285  (via drill 0.6)
  other vias: 87,12.38
N$286  (via drill 0.6)
  other vias: 87,13.34
N$287  (via drill 0.6)
  other vias: 87,14.29
N$288  (via drill 0.6)
  other vias: 87,15.24
N$289  (via drill 0.6)
  other vias: 87,16.19
N$290  (via drill 0.6)
  other vias: 87,17.14
N$291  (via drill 0.6)
  other vias: 87,18.1
N$292  (via drill 0.6)
  other vias: 87,19.05
N$293  (via drill 0.6)
  other vias: 87,20
N$294  (via drill 0.6)
  other vias: 87,20.95
N$295  (via drill 0.6)
  other vias: 87,21.91
N$296  (via drill 0.6)
  other vias: 87,22.86
N$297  (via drill 0.6)
  other vias: 87,23.81
N$298  (via drill 0.6)
  other vias: 87,24.77
N$299  (via drill 0.6)
  other vias: 87,25.72
N$300  (via drill 0.6)
  other vias: 87,26.67
N$301  (via drill 0.6)
  other vias: 87,27.62
N$302  (via drill 0.6)
  other vias: 87,28.57
N$303  (via drill 0.6)
  other vias: 87,29.53
N$304  (via drill 0.6)
  other vias: 87,30.48
N$305  (via drill 0.6)
  other vias: 87,31.43
N$306  (via drill 0.6)
  other vias: 87,32.38
N$307  (via drill 0.6)
  other vias: 87,33.34
N$308  (via drill 0.6)
  other vias: 87,34.29
N$309  (via drill 0.6)
  other vias: 87,35.24
N$310  (via drill 0.6)
  other vias: 87,36.2
N$311  (via drill 0.6)
  other vias: 87,37.15
N$312  (via drill 0.6)
  other vias: 87,38.1
N$313  (via drill 0.6)
  other vias: 87,39.05
N$314  (via drill 0.6)
  other vias: 87,40.01
N$315  (via drill 0.6)
  other vias: 87,40.96
N$316  (via drill 0.6)
  other vias: 87,41.91
N$317  (via drill 0.6)
  other vias: 87,42.86
N$318  (via drill 0.6)
  other vias: 87,43.81
N$319  (via drill 0.6)
  other vias: 87,44.77
N$320  (via drill 0.6)
  other vias: 87,45.72
N$321  (via drill 0.6)
  other vias: 87,46.67
N$322  (via drill 0.6)
  other vias: 87,47.62
N$323  (via drill 0.6)
  other vias: 87,48.58
N$324  (via drill 0.6)
  other vias: 87,49.53
N$325  (via drill 0.6)
  other vias: 87,50.48
N$326  (via drill 0.6)
  other vias: 87,51.44
N$327  (via drill 0.6)
  other vias: 87,52.39
N$328  (via drill 0.6)
  other vias: 87,53.34
N$329  (via drill 0.6)
  other vias: 87,54.29
N$330  (via drill 0.6)
  other vias: 87,0
N$331  (via drill 0.6)
  other vias: 87,0.95
N$332  (via drill 0.6)
  other vias: 87,1.91
N$333  (via drill 0.6)
  other vias: 87,2.86
N$334  (via drill 0.6)
  other vias: 87,3.81
N$335  (via drill 0.6)
  other vias: 87,4.76
N$336  (via drill 0.6)
  other vias: 87,5.71
N$337  (via drill 0.6)
  other vias: 87,6.67
N$338  (via drill 0.6)
  other vias: 87,7.62
N$339  (via drill 0.6)
  other vias: 87,8.57
N$341
  Top 0.254: R16.2 U$3.A
N$343
  Top 0.254: R17.2 LED1.1 | LED1.1
N$344
  Top 0.254: R19.2 23.04,9.37 LED1.3
N$345
  Top 0.406: 55.24,51.12 55.24,39.05 74.93,39.05 74.93,51.12 55.24,51.12
OE1
  Top 0.254: JP4.14 JP4.13 42.55,37.15 41.44,37.15 U$1.38
OE2/GCLK2
  Top 0.254: JP4.10 JP4.9 37.47,36.2 39.84,36.2 U$1.40
TCK
  Top 0.254: JP3.14 JP3.13 53.34,21.27 53.34,23.8 U$1.26
TDI
  Top 0.254: JP1.1 JP1.2 25.72,36.83 25.72,34.92 26.35,34.92 26.35,33.02 27.3,33.02 27.3,31.11 27.94,31.11 27.94,29.4 U$1.1
TDO
  Top 0.254: JP3.4 JP3.3 53.98,33.97 53.98,32.07 53.34,32.07 53.34,30.8 48.26,30.8 48.26,28.6 U$1.32
TMS
  Top 0.254: JP1.13 JP1.14 25.72,21.59 25.72,23.5 26.35,23.5 26.35,24.6 U$1.7

### Text on the board
Top: VCC | GND | 1 TDI 8 TDO / 2 GND 7 VCC / 3 TMS 6 TCK / 4 VCC 5 GND | 1 | 8 | 2 | 7 | 3 | 6 | 4 | 5 | EPM3032A | GND